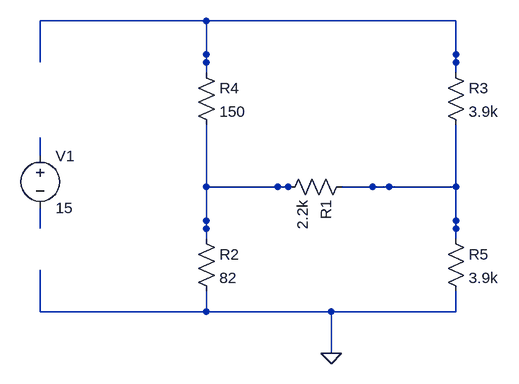
[diagram p0: schematic pannel3.asc]
pannel3.asc, the LTspice schematic file:
Version 4
SHEET 1 880 680
WIRE 512 528 512 500
WIRE 512 640 512 608
SYMBOL res 496 512 R0
SYMATTR InstName R2
SYMATTR Value 82
WIRE 896 272 896 244
WIRE 896 384 896 352
SYMBOL res 880 256 R0
SYMATTR InstName R3
SYMATTR Value 3.9k
WIRE 512 272 512 244
WIRE 512 384 512 352
SYMBOL res 496 256 R0
SYMATTR InstName R4
SYMATTR Value 150
WIRE 896 528 896 500
WIRE 896 640 896 608
SYMBOL res 880 512 R0
SYMATTR InstName R5
SYMATTR Value 3.9k
WIRE 720 448 793 448
WIRE 622 448 638 448
SYMBOL res 736 432 R90
SYMATTR InstName R1
SYMATTR Value 2.2k
FLAG 704 704 0
WIRE 256 400 256 372
WIRE 256 512 256 480
SYMBOL voltage 256 384 R0
SYMATTR InstName V1
SYMATTR Value 15
WIRE 704 640 704 704
WIRE 640 640 704 640
WIRE 704 640 768 640
WIRE 832 640 896 640
WIRE 512 640 576 640
WIRE 448 640 512 640
WIRE 896 384 896 448
WIRE 896 448 896 512
WIRE 832 448 896 448
WIRE 512 384 512 448
WIRE 512 448 576 448
WIRE 512 448 512 512
WIRE 512 192 576 192
WIRE 448 192 512 192
WIRE 512 192 512 256
WIRE 896 192 896 256
WIRE 832 192 896 192
WIRE 256 192 320 192
WIRE 256 192 256 256
WIRE 256 576 256 640
WIRE 256 640 320 640
WIRE 384 192 448 192
WIRE 320 192 384 192
WIRE 320 640 384 640
WIRE 384 640 448 640
WIRE 768 192 832 192
WIRE 704 192 768 192
WIRE 640 192 704 192
WIRE 576 192 640 192
WIRE 768 640 832 640
WIRE 576 640 640 640
WIRE 576 448 640 448
WIRE 768 448 832 448

The netlist it stands for:
* pannel3.asc
R2 N001 0 82
R3 N002 N003 3.9k
R4 N002 N001 150
R5 N003 0 3.9k
R1 N003 N001 2.2k
V1 N004 N005 15
.backanno
.end